# EAGLE schematic gps_15 (EAGLE 7.2.0)
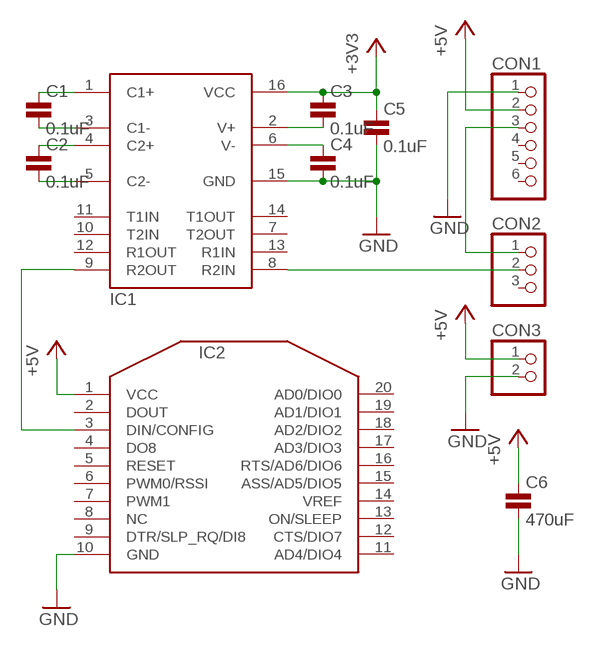
[diagram p0: schematic, sheet 1]

## Parts
C1  0.1uF  CC025-025X050  [C025-025X050]
C2  0.1uF  CC025-025X050  [C025-025X050]
C3  0.1uF  CC025-025X050  [C025-025X050]
C4  0.1uF  CC025-025X050  [C025-025X050]
C5  0.1uF  CC025-025X050  [C025-025X050]
C6  470uF  CC025-025X050  [C025-025X050]
CON1  PINHD-1X6  [1X06]
CON2  PINHD-1X3  [1X03]
CON3  PINHD-1X2  [1X02]
IC1  ADM3202ADM3202AN  [IC16PIN]
IC2  XBEE-PRO2.54MM  [AE-XBEE-REG-DIP]

## Nets
+3V3: C3.1 C5.1 IC1.16(VCC)
+5V: C6.1 CON1.2 CON3.1 IC2.1(VCC)
GND: C4.2 C5.2 CON1.1 CON3.2 IC1.15(GND) IC2.10(GND)
GPS_OUT: CON1.3 CON2.1
N$1: CON2.2 IC1.8(R2IN)
N$2: IC1.9(R2OUT) IC2.3(DIN/CONFIG)
N$3: C2.1 IC1.4(C2+)
N$4: C2.2 IC1.5(C2-)
N$5: C1.1 IC1.1(C1+)
N$6: C1.2 IC1.3(C1-)
N$7: C4.1 IC1.6(V-)
N$10: C3.2 IC1.2(V+)
Unconnected: C6.2 CON1.4 CON1.5 CON1.6 CON2.3 IC1.7(T2OUT) IC1.10(T2IN) IC1.11(T1IN) IC1.12(R1OUT) IC1.13(R1IN) IC1.14(T1OUT) IC2.2(DOUT) IC2.4(DO8) IC2.5(RESET) IC2.6(PWM0/RSSI) IC2.7(PWM1) IC2.8(NC) IC2.9(DTR/SLP_RQ/DI8) IC2.11(AD4/DIO4) IC2.12(CTS/DIO7) IC2.13(ON/SLEEP) IC2.14(VREF) IC2.15(ASS/AD5/DIO5) IC2.16(RTS/AD6/DIO6) IC2.17(AD3/DIO3) IC2.18(AD2/DIO2) IC2.19(AD1/DIO1) IC2.20(AD0/DIO0)

## Library data of the parts
C1-C6 = untitled:C: CAPACITOR
CON1 = pinhead:PINHD-1X6: PIN HEADER
CON2 = pinhead:PINHD-1X3: PIN HEADER
CON3 = pinhead:PINHD-1X2: PIN HEADER
IC1 = untitled:ADM3202
IC2 = untitled:XBEE-PRO: XBee